# EAGLE design Balloon_Cut-Down (EAGLE 9.0.0)

## Sheet 1 of 2
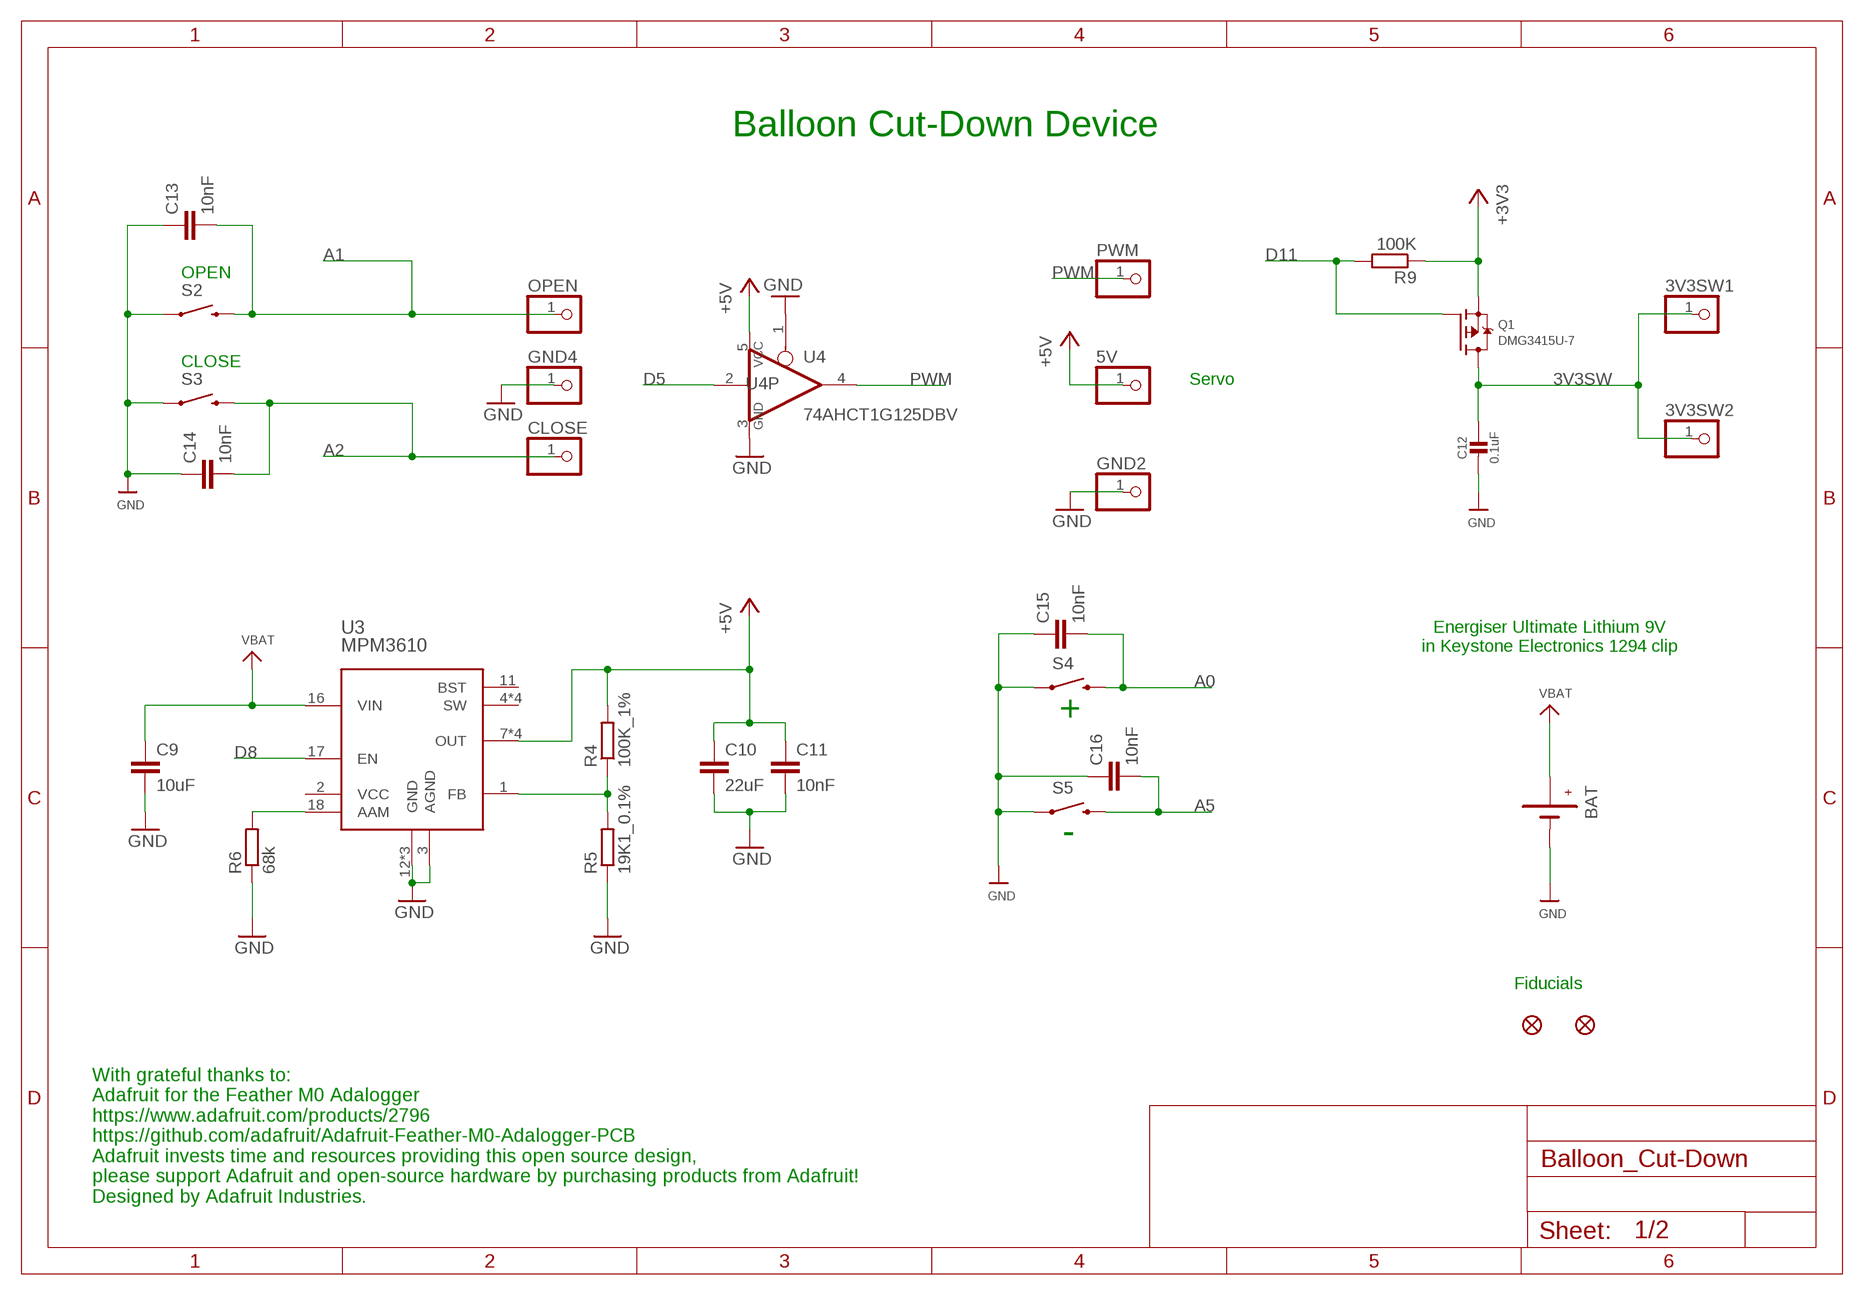
[diagram p0: schematic, sheet 1]

### Parts
3V3SW1  PINHD-1X1  [1X01]
3V3SW2  PINHD-1X1  [1X01]
5V  PINHD-1X1  [1X01]
BAT  BATTERYBATTERY-9V-KEYSTONE1294  [BATTERY-9V-KEYSTONE1294]
C9  10uF  C-EUC0805  [C0805]
C10  22uF  C-EUC0805  [C0805]
C11  10nF  C-EUC0805  [C0805]
C12  0.1uF  CAP_CERAMIC0805-NOOUTLINE  [0805-NO]
C13  10nF  C-EUC0805  [C0805]
C14  10nF  C-EUC0805  [C0805]
C15  10nF  C-EUC0805  [C0805]
C16  10nF  C-EUC0805  [C0805]
CLOSE  PINHD-1X1  [1X01]
FD1  FIDUCIAL1X2  [FIDUCIAL-1X2]
FD2  FIDUCIAL1X2  [FIDUCIAL-1X2]
GND2  PINHD-1X1  [1X01]
GND4  PINHD-1X1  [1X01]
OPEN  PINHD-1X1  [1X01]
PWM  PINHD-1X1  [1X01]
Q1  DMG3415U-7  MOSFET-PWIDE  [SOT23-WIDE]
R4  100K_1%  R-EU_R0805  [R0805]
R5  19K1_0.1%  R-EU_R0805  [R0805]
R6  68k  R-EU_R0805  [R0805]
R9  100K  R-EU_R0603  [R0603]
S2  SWITCH-MOMENTARY-2PTH  [TACTILE-PTH]
S3  SWITCH-MOMENTARY-2PTH  [TACTILE-PTH]
S4  SWITCH-MOMENTARY-2PTH  [TACTILE-PTH]
S5  SWITCH-MOMENTARY-2PTH  [TACTILE-PTH]
U3  MPM3610  2093_MPM3610GQV-P  [QFN-20]
U4  74AHCT1G125DBV  [SOT23-5]

### Nets
3V3SW: 3V3SW1.1 3V3SW2.1 C12.1 Q1.3(D)
+3V3: Q1.2(S) R9.1 ; also sheet 2
+5V: 5V.1 C10.1 C11.1 R4.2 U3.7(OUT) U3.8(OUT) U3.9(OUT) U3.20(OUT) U4.5(VCC)
A0: C15.2 S4.3 ; also sheet 2
A1: C13.2 OPEN.1 S2.3 ; also sheet 2
A2: C14.2 CLOSE.1 S3.3 ; also sheet 2
A5: C16.2 S5.3 ; also sheet 2
D5: U4.2(I) ; also sheet 2
D8: U3.17(EN) ; also sheet 2
D11: Q1.1(G) R9.2 ; also sheet 2
GND: BAT.GND(-) C9.2 C10.2 C11.2 C12.2 C13.1 C14.1 C15.1 C16.1 GND2.1 GND4.1 R5.1 R6.1 S2.1 S3.1 S4.1 S5.1 U3.3(AGND) U3.12(GND) U3.13(GND) U3.14(GND) U4.1(OE) U4.3(GND) ; also sheet 2
N$26: R4.1 R5.2 U3.1(FB)
N$29: R6.2 U3.18(AAM)
PWM: PWM.1 U4.4(O)
VBAT: BAT.PWR(+) C9.1 U3.16(VIN) ; also sheet 2
Unconnected: U3.2(VCC) U3.4(SW) U3.5(SW) U3.6(SW) U3.11(BST) U3.19(SW)

### Notes on the sheet
- Balloon Cut-Down Device
- OPEN
- CLOSE
- Servo
- Energiser Ultimate Lithium 9V
  in Keystone Electronics 1294 clip
- +
- -
- Fiducials
- With grateful thanks to:
  Adafruit for the Feather M0 Adalogger
  https://www.adafruit.com/products/2796
  https://github.com/adafruit/Adafruit-Feather-M0-Adalogger-PCB
  Adafruit invests time and resources providing this open source design,
  please support Adafruit and open-source hardware by purchasing products from Adafruit!
  Designed by Adafruit Industries.

## Sheet 2 of 2
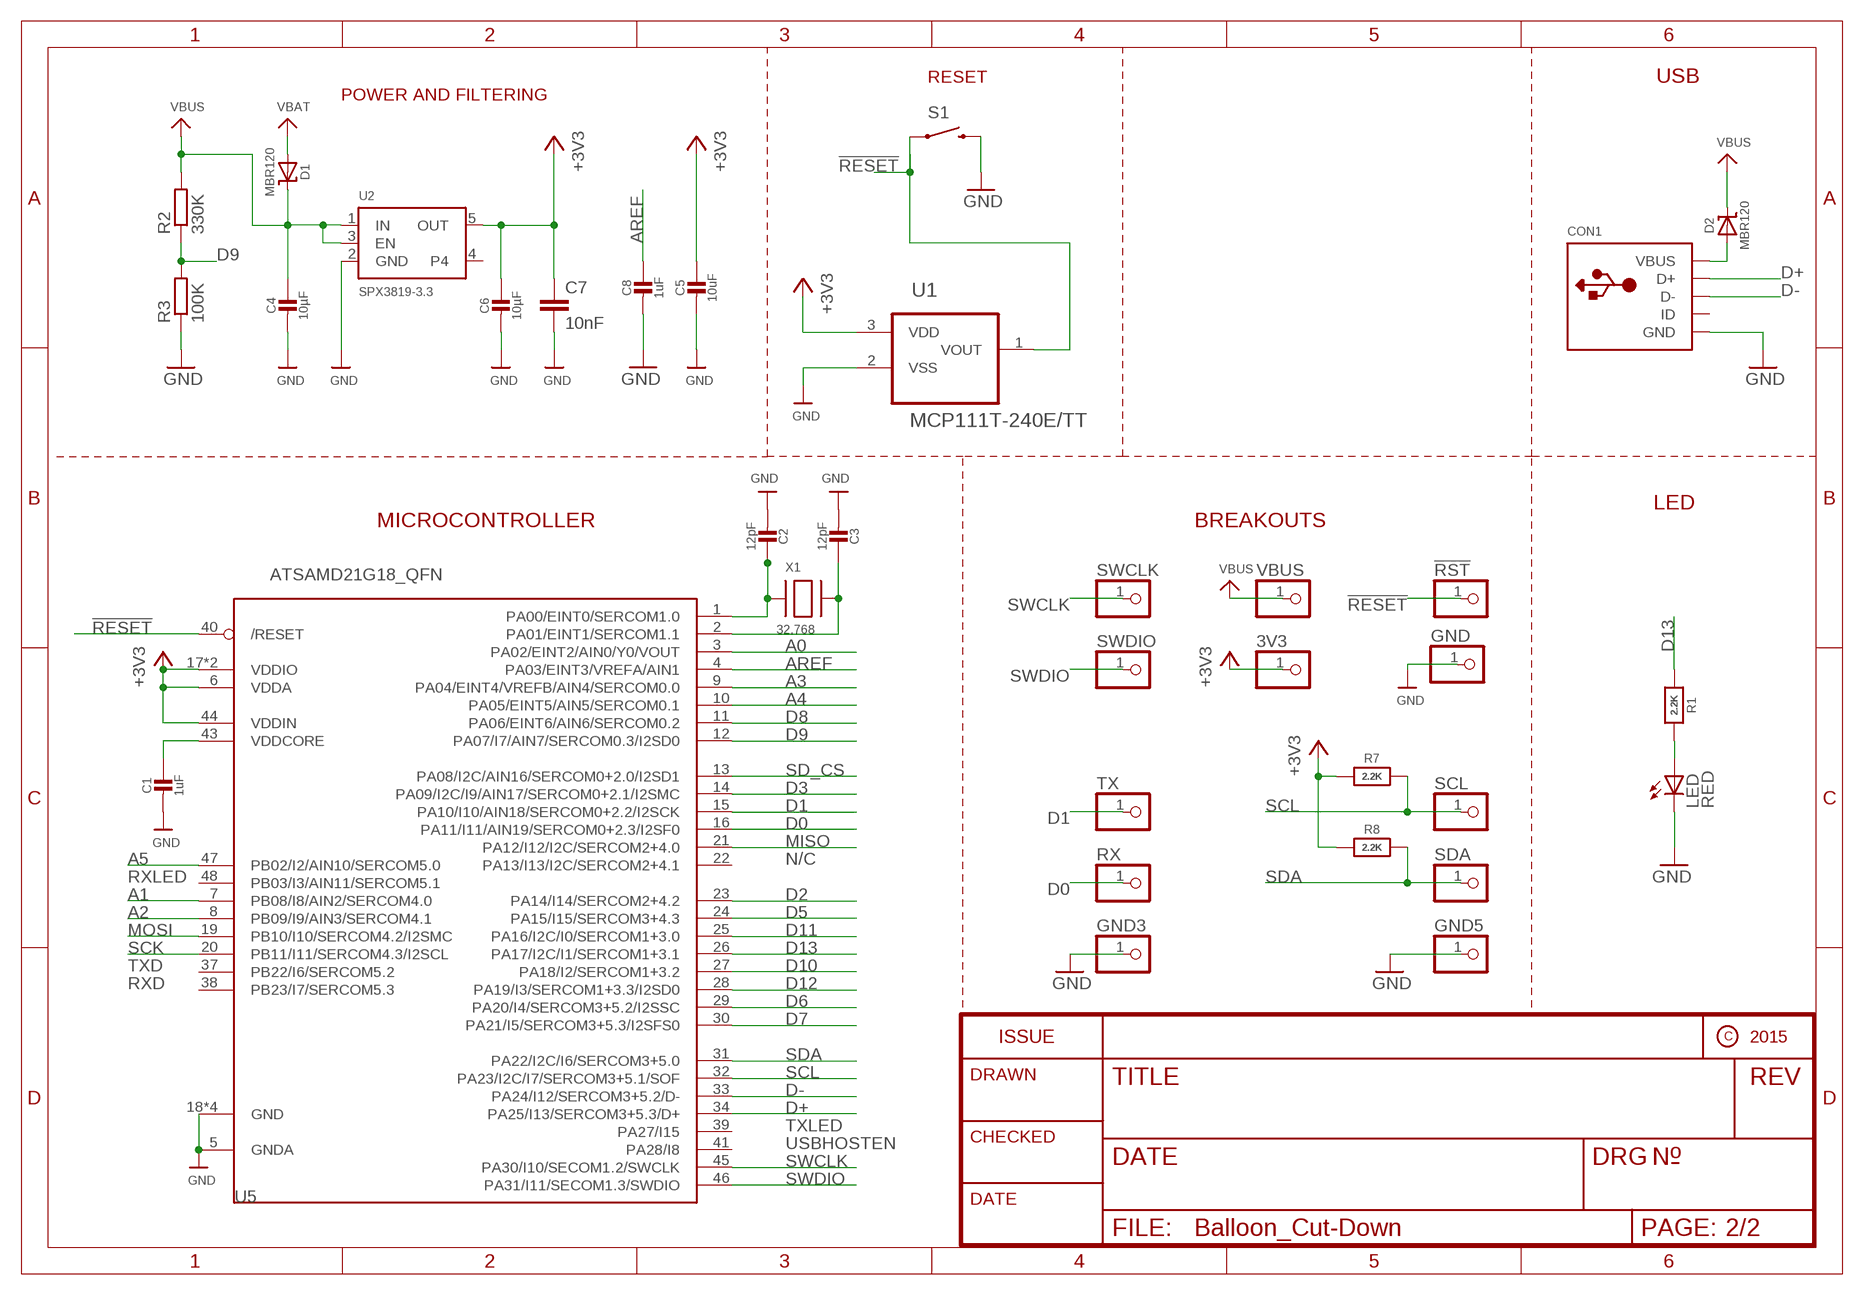
[diagram p1: schematic, sheet 2]

### Parts
3V3  PINHD-1X1  [1X01]
!RST  PINHD-1X1  [1X01]
C1  1uF  CAP_CERAMIC0603_NO  [0603-NO]
C2  12pF  CAP_CERAMIC0603_NO  [0603-NO]
C3  12pF  CAP_CERAMIC0603_NO  [0603-NO]
C4  10µF  CAP_CERAMIC0805-NOOUTLINE  [0805-NO]
C5  10uF  CAP_CERAMIC0805-NOOUTLINE  [0805-NO]
C6  10µF  CAP_CERAMIC0805-NOOUTLINE  [0805-NO]
C7  10nF  C-EUC0805  [C0805]
C8  1uF  CAP_CERAMIC0603_NO  [0603-NO]
CON1  USBFCI_10103594  [FCI_10103594]
D1  MBR120  DIODE-SCHOTTKYSOD-123  [SOD-123]
D2  MBR120  DIODE-SCHOTTKYSOD-123  [SOD-123]
GND  PINHD-1X1  [1X01]
GND3  PINHD-1X1  [1X01]
GND5  PINHD-1X1  [1X01]
LED  RED  LED3MM  [LED3MM]
R1  2.2K  RESISTOR_0603_NOOUT  [0603-NO]
R2  330K  R-EU_R0603  [R0603]
R3  100K  R-EU_R0603  [R0603]
R7  2.2K  RESISTOR_0603_NOOUT  [0603-NO]
R8  2.2K  RESISTOR_0603_NOOUT  [0603-NO]
RX  PINHD-1X1  [1X01]
S1  SWITCH-MOMENTARY-2PTH  [TACTILE-PTH]
SCL  PINHD-1X1  [1X01]
SDA  PINHD-1X1  [1X01]
SWCLK  PINHD-1X1  [1X01]
SWDIO  PINHD-1X1  [1X01]
TX  PINHD-1X1  [1X01]
U1  MCP111T-240E/TT  MCP111T-270E/TT  [SOT95P237X112-3N]
U2  SPX3819-3.3  VREG_SOT23-5  [SOT23-5]
U5  ATSAMD21G18_QFN  ATSAMD21J_QFN  [TQFN48_7MM]
VBUS  PINHD-1X1  [1X01]
X1  32.768  XTAL-3.2X1.5  [XTAL3215]

### Nets
!RESET: !RST.1 S1.1 U1.1(VOUT) U5.40(/RESET)
+3V3: 3V3.1 C5.1 C6.1 C7.1 R7.1 R8.1 U1.3(VDD) U2.5(OUT) U5.6(VDDA) U5.17(VDDIO) U5.36(VDDIO) U5.44(VDDIN) ; also sheet 1
A0: U5.3(PA02/EINT2/AIN0/Y0/VOUT) ; also sheet 1
A1: U5.7(PB08/I8/AIN2/SERCOM4.0) ; also sheet 1
A2: U5.8(PB09/I9/AIN3/SERCOM4.1) ; also sheet 1
A3: U5.9(PA04/EINT4/VREFB/AIN4/SERCOM0.0)
A4: U5.10(PA05/EINT5/AIN5/SERCOM0.1)
A5: U5.47(PB02/I2/AIN10/SERCOM5.0) ; also sheet 1
AREF: C8.1 U5.4(PA03/EINT3/VREFA/AIN1)
D0: RX.1 U5.16(PA11/I11/AIN19/SERCOM0+2.3/I2SF0)
D1: TX.1 U5.15(PA10/I10/AIN18/SERCOM0+2.2/I2SCK)
D2: U5.23(PA14/I14/SERCOM2+4.2)
D3: U5.14(PA09/I2C/I9/AIN17/SERCOM0+2.1/I2SMC)
D5: U5.24(PA15/I15/SERCOM3+4.3) ; also sheet 1
D6: U5.29(PA20/I4/SERCOM3+5.2/I2SSC)
D7: U5.30(PA21/I5/SERCOM3+5.3/I2SFS0)
D8: U5.11(PA06/EINT6/AIN6/SERCOM0.2) ; also sheet 1
D9: R2.1 R3.2 U5.12(PA07/I7/AIN7/SERCOM0.3/I2SD0)
D10: U5.27(PA18/I2/SERCOM1+3.2)
D11: U5.25(PA16/I2C/I0/SERCOM1+3.0) ; also sheet 1
D12: U5.28(PA19/I3/SERCOM1+3.3/I2SD0)
D13: R1.1 U5.26(PA17/I2C/I1/SERCOM1+3.1)
D+: CON1.D+ U5.34(PA25/I13/SERCOM3+5.3/D+)
D-: CON1.D- U5.33(PA24/I12/SERCOM3+5.2/D-)
GND: C1.2 C2.2 C3.2 C4.2 C5.2 C6.2 C7.2 C8.2 CON1.BASE@1(GND) CON1.BASE@2(GND) CON1.GND CON1.SPRT@1(GND) CON1.SPRT@2(GND) CON1.SPRT@3(GND) CON1.SPRT@4(GND) GND3.1 GND5.1 GND.1 LED.K(C) R3.1 S1.3 U1.2(VSS) U2.2(GND) U5.5(GNDA) U5.18(GND) U5.35(GND) U5.42(GND) U5.THERMAL(GND) ; also sheet 1
MISO: U5.21(PA12/I12/I2C/SERCOM2+4.0)
MOSI: U5.19(PB10/I10/SERCOM4.2/I2SMC)
N$3: LED.A R1.2
N$5: C2.1 U5.1(PA00/EINT0/SERCOM1.0) X1.P$1
N$7: C3.1 U5.2(PA01/EINT1/SERCOM1.1) X1.P$2
N$16: CON1.VBUS D2.A
SCK: U5.20(PB11/I11/SERCOM4.3/I2SCL)
SCL: R7.2 SCL.1 U5.32(PA23/I2C/I7/SERCOM3+5.1/SOF)
SD_CS: U5.13(PA08/I2C/AIN16/SERCOM0+2.0/I2SD1)
SDA: R8.2 SDA.1 U5.31(PA22/I2C/I6/SERCOM3+5.0)
SWCLK: SWCLK.1 U5.45(PA30/I10/SECOM1.2/SWCLK)
SWDIO: SWDIO.1 U5.46(PA31/I11/SECOM1.3/SWDIO)
VBAT: D1.A ; also sheet 1
VBUS: C4.1 D1.C D2.C R2.2 U2.1(IN) U2.3(EN) VBUS.1
VDDCORE1: C1.1 U5.43(VDDCORE)
Unconnected: CON1.ID U2.4 U5.22(PA13/I13/I2C/SERCOM2+4.1) U5.37(PB22/I6/SERCOM5.2) U5.38(PB23/I7/SERCOM5.3) U5.39(PA27/I15) U5.41(PA28/I8) U5.48(PB03/I3/AIN11/SERCOM5.1)

### Notes on the sheet
- RESET | USB
- POWER AND FILTERING
- LED
- MICROCONTROLLER | BREAKOUTS
- N/C
- RXLED
- TXD
- RXD
- TXLED
- USBHOSTEN

## Library data of the parts
3V3 3V3SW1 3V3SW2 5V !RST CLOSE GND GND2-GND5 OPEN PWM RX SCL SDA SWCLK SWDIO TX VBUS = adafruit:PINHD-1X1: Pin header 1x1 for 0.1" spacing With round pins
BAT = SparkFun-Electromechanical:BATTERY: Battery Holders Various common sizes : AA, AAA, 18650 (PRT-12895), 20mm coin cell and 12mm coin cell. 20MM_4LEGS, BATT-10373
C1-C6 C8 C12 = microbuilder:CAP_CERAMIC: Ceramic Capacitors For new designs, use the packages preceded by an '_' character since they are more reliable: The following footprints should be used on most boards: _0402 - Standard footprint for regular board layouts _0603 - Standard footprint for regular board layouts _0805 - Standard footprint for regular board layouts _1206 - Standard footprint for regular board layouts For extremely tight-pitch boards where space is at a premium, the following 'micro-pitch' footprints can be used (smaller pads, no silkscreen outline, etc.): _0402MP - Micro-pitch footprint for very dense/compact boards _0603MP - Micro-pitch footprint for very dense/compact boards _0805MP - Micro-pitch footprint for very dense/compact boards _1206MP - Micro-pitch footprint for very dense/compact boards
C7 C9-C11 C13-C16 = rcl:C-EU: CAPACITOR, European symbol; SPICEPREFIX: C
CON1 = microbuilder:USB: USB Connectors USBMINIB - Surface Mount Female Mini-B USB Connector 4UConnector: 06564
D1 D2 = microbuilder:DIODE-SCHOTTKY
FD1 FD2 = SparkFun-Aesthetics:FIDUCIAL: Fiducial Alignment Points Various fiducial points for machine vision alignment.
LED = adafruit:LED: LED OSRAM: - CHIPLED LG R971, LG N971, LY N971, LG Q971, LY Q971, LO R971, LY R971 LH N974, LH R974 LS Q976, LO Q976, LY Q976 LO Q996 - Hyper CHIPLED LW Q18S LB Q993, LB Q99A, LB R99A - SideLED LS A670, LO A670, LY A670, LG A670, LP A670 LB A673, LV A673, LT A673, LW A673 LH A674 LY A675 LS A676, LA A676, LO A676, LY A676, LW A676 LS A679, LY A679, LG A679 - Hyper Micro SIDELED® LS Y876, LA Y876, LO Y876, LY Y876 LT Y87S - SmartLED LW L88C, LW L88S LB L89C, LB L89S, LG L890 LS L89K, LO L89K, LY L89K LS L896, LA L896, LO L896, LY L896 - TOPLED LS T670, LO T670, LY T670, LG T670, LP T670 LSG T670, LSP T670, LSY T670, LOP T670, LYG T670 LG T671, LOG T671, LSG T671 LB T673, LV T673, LT T673, LW T673 LH T674 LS T676, LA T676, LO T676, LY T676, LB T676, LH T676, LSB T676, LW T676 LB T67C, LV T67C, LT T67C, LS T67K, LO T67K, LY T67K, LW E67C LS E67B, LA E67B, LO E67B, LY E67B, LB E67C, LV E67C, LT E67C LW T67C LS T679, LY T679, LG T679 LS T770, LO T770, LY T770, LG T770, LP T770 LB T773, LV T773, LT T773, LW T773 LH T774 LS E675, LA E675, LY E675, LS T675 LS T776, LA T776, LO T776, LY T776, LB T776 LHGB T686 LT T68C, LB T68C - Hyper Mini TOPLED® LB M676 - Mini TOPLED Santana® LG M470 LS M47K, LO M47K, LY M47K Source: http://www.osram.convergy.de/
Q1 = microbuilder:MOSFET-P: P-Channel Mosfet LEGEND VDS: Voltage Drain-Source ID: Drain Current RDS(ON): Drain-Source On-State Resistance VGS(TH): Gate-Source Threshold Voltage CISS: Drain-Source Input Capacitance SOT-23 Name VDS ID RDS(ON) VGS(TH) CISS Order Number IRLML5103 30V 760mA 600 mOhm -- 75pF @ 25V Digikey: IRLML5103PBFCT-ND IRLML6401 12V 4.3A 50 mOhm 950mV @ 250µA 830pF @ 10V Digikey: IRLML6401PBFTR-ND NTR0202PL 20V 400mA 800 mOhm 2.3V @ 250uA 70pF @ 5V Digikey: NTR0202PLT1GOSTR-ND NTR4101PT1G 20V 1.8A 85 mOhm 1.2V @ 250uA 675pF @ 10V Digikey: NTR4101PT1GOSCT-ND DMP2004K 20V 600mA 900 mOhm 1V @ 250uA 175pF @ 16V Digikey: DMP2004KDICT-ND PMV65XP 20V 3.9A 76 mOhm 950mV @ 1mA 725pF @ 20V Digikey: 568-2358-2-ND TO-252 Name VDS ID RDS(ON) VGS(TH) CISS Order Number AOD417 30V 25A 34 mOhm 3V @ 250µA 920pF @ 15V Digikey: 785-1106-2-ND
R1 R7 R8 = microbuilder:RESISTOR: Resistors For new designs, use the packages preceded by an '_' character since they are more reliable: The following footprints should be used on most boards: _0402 - Standard footprint for regular board layouts _0603 - Standard footprint for regular board layouts _0805 - Standard footprint for regular board layouts _1206 - Standard footprint for regular board layouts For extremely tight-pitch boards where space is at a premium, the following 'micro-pitch' footprints can be used (smaller pads, no silkscreen outline, etc.): _0402MP - Micro-pitch footprint for very dense/compact boards _0603MP - Micro-pitch footprint for very dense/compact boards _0805MP - Micro-pitch footprint for very dense/compact boards _1206MP - Micro-pitch footprint for very dense/compact boards
R2-R6 R9 = rcl:R-EU_: RESISTOR, European symbol; SPICEPREFIX: R
S1-S5 = SparkFun-Electromechanical:SWITCH-MOMENTARY-2: Various NO switches- pushbuttons, reed, etc; PROD_ID: SWCH-08441
U1 = Microchip-MCP11:MCP11: Micropower Voltage Detector ,SOT23-3;; MPN: MCP111T-240E/TT; OC_FARNELL: 1851877; OC_NEWARK: 56J7328; PACKAGE: SOT23-3; SUPPLIER: MICROCHIP
U2 = microbuilder:VREG_SOT23-5: SOT23-5 Fixed Voltage Regulators Part Current Out V Out V In V Dropout θJA (°C/W) TJ (°C) Digikey Part No. ADP121 150mA 3.3V 3.4-5.5V 0.09V @ 150mA -- -- ADP121-AUJZ33R7CT-ND ADP121 150mA 3.0V 3.1-5.5V 0.09V @ 150mA -- -- ADP121-AUJZ30R7CT-ND ADP122 300mA 3.3V 3.4-5.5V 0.085V @ 300mA -- -- ADP122AUJZ-3.3-R7CT-ND ADP1712 300mA 3.3V 3.5-5.5V 0.17V @ 300mA -- -- ADP1712AUJZ-3.3-R7TR-ND AP7311 (Low Cost) 150mA 3.3V 3.5-6V 0.15V @ 150mA -- -- AP7311-33WG-7DICT-ND LD39015M18R 150mA 1.8V 1.9V-5.5V 0.08V @ 100mA -- -- 497-6977-1-ND LP2985A-33DBVR 150mA 3.3V 3.3-16V 0.28V @ 150mA 206 150 296-18479-1-ND MCP1824T-3302E/OT 300mA 3.3V 3.5V-6V 0.2V @ 300mA -- -- MCP1824T-3302E/OTCT-ND MIC5205-2.5YM5 TR 150mA 2.5V 2.7-16V 0.165V @ 150mA -- -- 576-1257-2-ND MIC5205-3.0YM5 TR 150mA 3.0V 3.2V-16V 0.165V @ 150mA -- -- 576-1258-2-ND MIC5205-3.3YM5 TR 150mA 3.3V 3.5V-16V 0.165V @ 150mA -- -- 576-1259-2-ND TPS780330220 150mA 3.3V+2.2V 3.6-5.5V 250mV Max -- -- 296-23332-1-ND TDA3663/N1,135 100mA 3.3V 3.5-45V 0.18V @ 50mA -- -- 568-5343-1-ND Max operating temp can be calculated using θJA, TJ (max junction temperature), and power in watts. Set the "Maximum Ambient Temperature" until it reaches TJ ("Max Junction Temperature"), which is the absolute limit for safe use of the regulator: Heat Sink Temperature Calculator <http://www.daycounter.com/Calculators/Heat-Sink-Temperature-Calculator.phtml> For example, With 12V source into a 3.3V LP2985 and a 30mA load, we are dissipating (12V-3.3V) * 0.03A = 0.261W. With a θJA of 206 °C/W, a TJ of 150°C, and 261mW we can safely use the chip without a heat sink up to 75°C (=147.1°C Junction Temperature).
U3 = IntegratedCircuits:2093_MPM3610GQV-P: MPM3610 Step Down Regulator; CASE: QFN-20; PART_NUMBER: MPM3610GQV-P; TYPE: Circuito_Integrato
U4 = 74xx-little-us:74*1G125: Single Bus Buffer Gate with 3-State Output
U5 = microbuilder:ATSAMD21J
X1 = adafruit2:XTAL: Low cost SMT crystals, no capacitors included http://www.ladyada.net/library/eagle

## Net classes
2 gnd: width 0.254 mm, drill 0.254 mm, clearance 0.178 mm
3 usbvcc: width 0.203 mm, drill 0.406 mm, clearance 0.178 mm

## Board
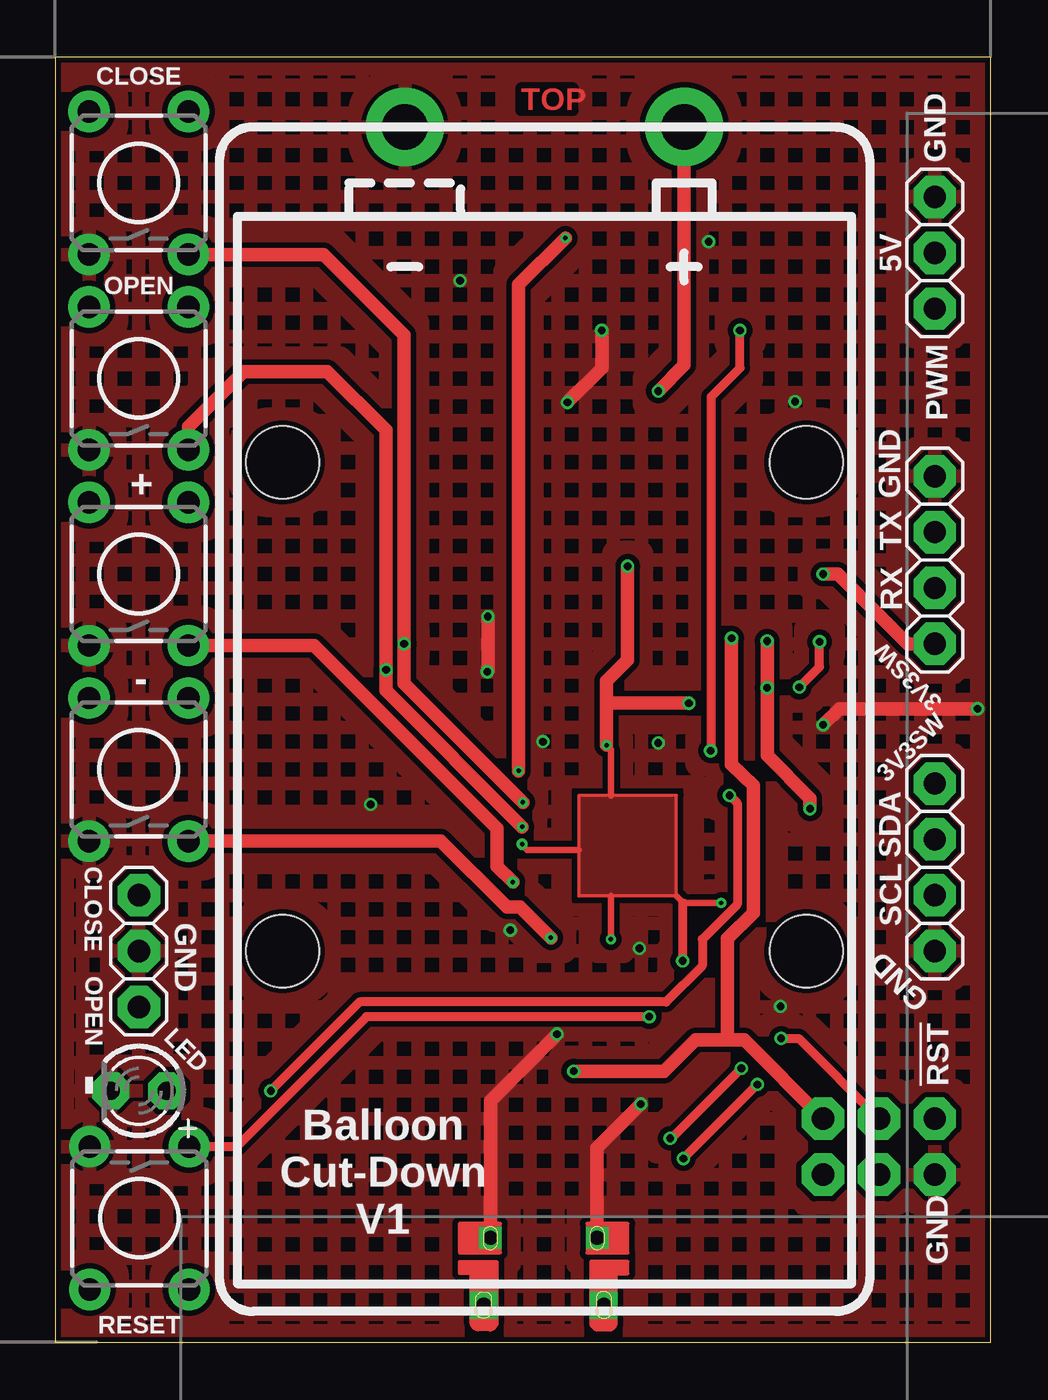
[diagram p2: board, top side]
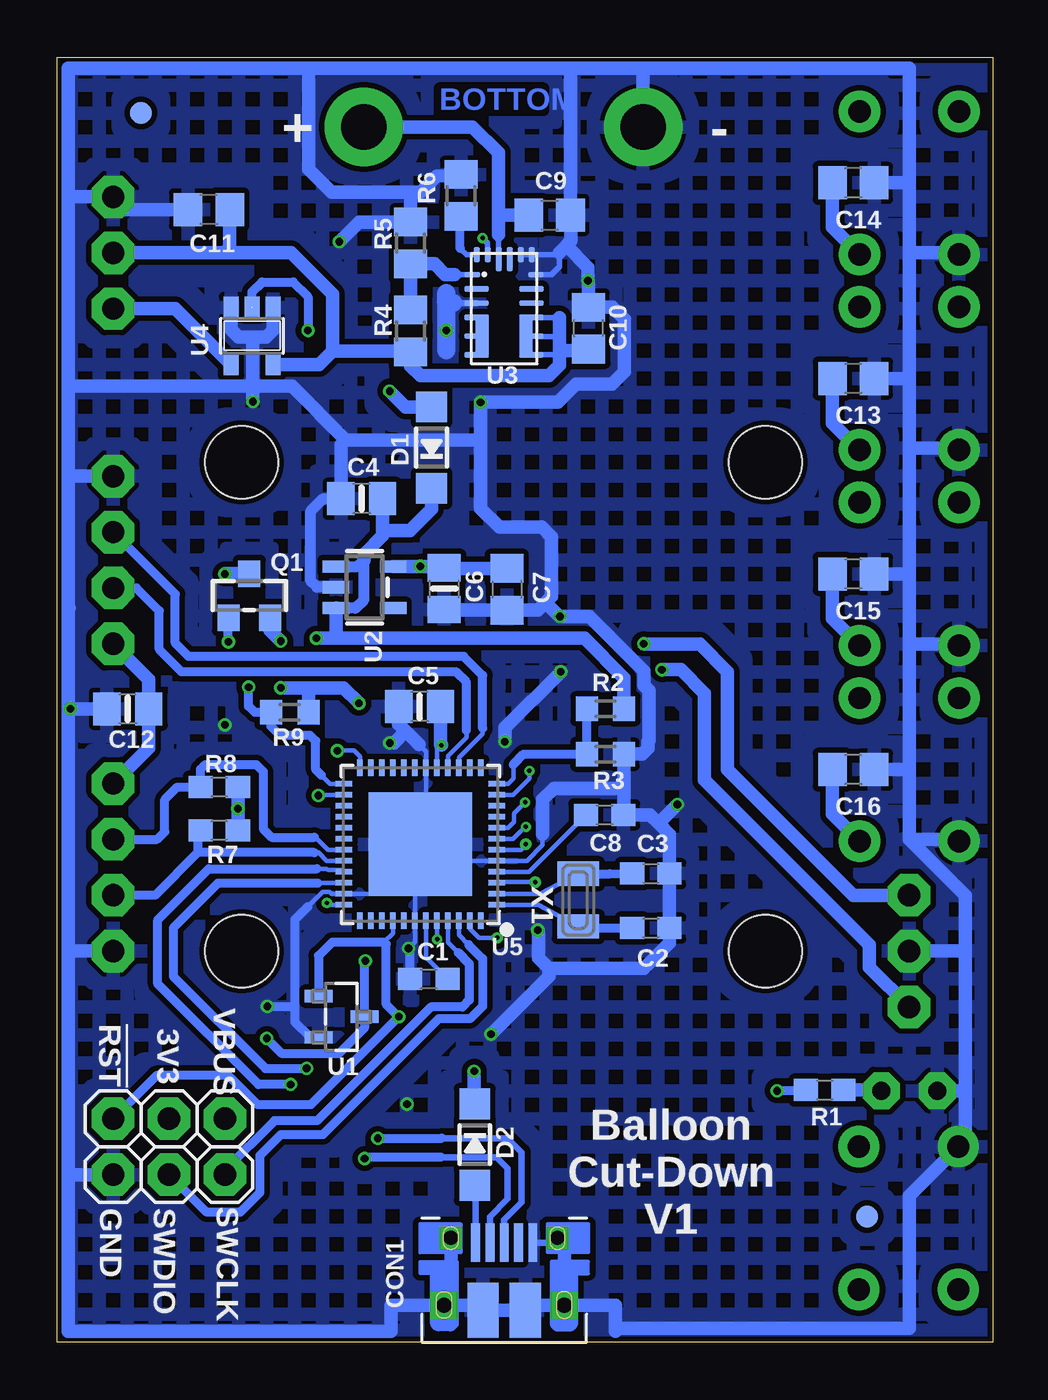
[diagram p3: board, bottom side, seen from below]

Size 42.55 x 58.42 mm. Coordinates in mm from the lower left corner, seen from the top.
Outline: 0,0 42.55,0 42.55,58.42 0,58.42 0,0
Copper layers (1*16): Top 0.018mm / dielectric 1.55mm / Bottom 0.018mm
Design rules "Multi-CB_2L_125um-Tracks_OL35um *": minimum track width 0.125mm, minimum drill 0.2mm, track to track 0.125mm, track to pad 0.125mm, pad to pad 0.125mm, via to via 0.125mm, smd to smd 0mil, copper to edge 0.2mm, drill to drill 0.2mm, minimum pad ring 0.125mm, minimum via ring 0.125mm, stop-mask expansion 2mil, vias tented up to drill 0.45mm, thermal gap 0.2mm

### Footprints (pad centres in the part's own frame; a part is rotated, then mirrored left to right if it is on the bottom)
1X01 = drill 1.016 pad 1.93 octagon: 1 0,0
BATTERY-9V-KEYSTONE1294 = drill 2.057 pad 3.556: GND 0,-6.35; PWR 0,6.35 | hole 3.302: 15.24,11.913; 37.465,11.913; 15.24,-11.913; 37.465,-11.913
0603-NO = smd 1.1 x 1: 1 -0.85,0; 2 0.85,0
0805-NO = smd 1.24 x 1.5: 1 -0.95,0; 2 0.95,0
C0805 = smd 1.3 x 1.5: 1 -0.95,0; 2 0.95,0
FCI_10103594 = smd 1.425 x 2.5: BASE@1 -0.963,1.45; BASE@2 0.963,1.45 | smd 0.4 x 1.75: D+ 0,4.525; D- -0.65,4.525; GND 1.3,4.525; ID 0.65,4.525; VBUS -1.3,4.525 | drill 0.7 pad 1.25 square: SPRT@1 -2.736,1.679; SPRT@2 2.736,1.679 | drill 0.65 pad 1.016 square: SPRT@3 -2.426,4.747; SPRT@4 2.426,4.747
SOD-123 = smd 1.4 x 1.4: A 1.85,0; C -1.85,0
FIDUCIAL-1X2 = smd 1 x 1: 1 0,0
LED3MM = drill 0.813 pad 1.676 octagon: A -1.27,0; K 1.27,0
SOT23-WIDE = smd 1 x 1.2: 1 -0.95,-1; 2 0.95,-1; 3 0,1
R0603 = smd 1 x 1.1: 1 -0.85,0; 2 0.85,0
R0805 = smd 1.3 x 1.5: 1 -0.95,0; 2 0.95,0
TACTILE-PTH = drill 1.016 pad 1.88: 1 -3.251,2.261; 2 3.251,2.261; 3 -3.251,-2.261; 4 3.251,-2.261
SOT95P237X112-3N = smd 0.559 x 1.27: 1 -0.94,-1.041; 2 0.94,-1.041; 3 0,1.041
SOT23-5 = smd 0.55 x 1.2: 1 -0.95,-1.3; 2 0,-1.3; 3 0.95,-1.3; 4 0.95,1.3; 5 -0.95,1.3
QFN-20 = smd 0.7 x 0.25: 1 -1.45,1.55; 4 -1.45,-0.4; 5 -1.45,-1.25; 6 -1.45,-2.1; 7 1.45,-2.1; 8 1.45,-1.25; 9 1.45,-0.4; 12 1.45,1.55 | smd 1.1 x 0.25: 2 -1.25,0.9; 3 -1.25,0.25; 10 1.25,0.25; 11 1.25,0.9 | smd 0.25 x 0.7: 13 1.25,2.45; 14 0.75,2.45; 17 -0.75,2.45; 18 -1.25,2.45 | smd 0.25 x 1.1: 15 0.25,2.25; 16 -0.25,2.25 | smd 0.6 x 1.95: 19 -1,-1.25; 20 1,-1.25
SOT23-5' = smd 0.69 x 0.99: 1 -0.95,-1.29; 2 0,-1.29; 3 0.95,-1.29; 4 0.95,1.3; 5 -0.95,1.3
TQFN48_7MM = smd 0.25 x 0.75: 1 -2.75,-3.475; 2 -2.25,-3.475; 3 -1.75,-3.475; 4 -1.25,-3.475; 5 -0.75,-3.475; 6 -0.25,-3.475; 7 0.25,-3.475; 8 0.75,-3.475; 9 1.25,-3.475; 10 1.75,-3.475; 11 2.25,-3.475; 12 2.75,-3.475; 25 2.75,3.475; 26 2.25,3.475; 27 1.75,3.475; 28 1.25,3.475; 29 0.75,3.475; 30 0.25,3.475; 31 -0.25,3.475; 32 -0.75,3.475; 33 -1.25,3.475; 34 -1.75,3.475; 35 -2.25,3.475; 36 -2.75,3.475 | smd 0.75 x 0.25: 13 3.475,-2.75; 14 3.475,-2.25; 15 3.475,-1.75; 16 3.475,-1.25; 17 3.475,-0.75; 18 3.475,-0.25; 19 3.475,0.25; 20 3.475,0.75; 21 3.475,1.25; 22 3.475,1.75; 23 3.475,2.25; 24 3.475,2.75; 37 -3.475,2.75; 38 -3.475,2.25; 39 -3.475,1.75; 40 -3.475,1.25; 41 -3.475,0.75; 42 -3.475,0.25; 43 -3.475,-0.25; 44 -3.475,-0.75; 45 -3.475,-1.25; 46 -3.475,-1.75; 47 -3.475,-2.25; 48 -3.475,-2.75 | smd 4.7 x 4.7: THERMAL 0,0
XTAL3215 = smd 1.1 x 1.9: P$1 1.2,0; P$2 -1.2,0

### Placement (x,y rotation side)
3V3  37.47,10.16 270 bottom
3V3SW1  40.01,25.4 0 top
3V3SW2  40.01,31.75 0 top
5V  40.01,49.53 90 top
!RST  40.01,10.16 270 bottom
BAT  22.26,55.24 270 top
C1  25.65,16.51 180 bottom
C2  15.56,18.83 0 bottom
C3  15.56,21.3 0 bottom
C4  28.7,38.35 180 bottom
C5  26.07,28.89 180 bottom
C6  24.96,34.26 270 bottom
C7  22.1,34.23 270 bottom
C8  17.65,23.97 0 bottom
C9  20.16,51.24 0 bottom
C10  18.38,46.1 90 bottom
C11  35.66,51.5 180 bottom
C12  39.34,28.8 180 bottom
C13  6.35,43.81 180 bottom
C14  6.35,52.7 180 bottom
C15  6.35,34.92 180 bottom
C16  6.35,26.04 180 bottom
CLOSE  3.81,20.32 270 top
CON1  22.23,0 0 bottom
D1  25.53,40.67 90 bottom
D2  23.56,8.99 270 bottom
FD1  5.71,5.71 0 bottom
FD2  38.73,55.88 0 bottom
GND  40.01,7.62 90 bottom
GND2  40.01,52.07 90 top
GND3  40.01,39.37 90 top
GND4  3.81,17.78 270 top
GND5  40.01,17.78 0 top
LED  3.81,11.43 180 top
OPEN  3.81,15.24 270 top
PWM  40.01,46.99 270 top
Q1  33.81,33.94 0 bottom
R1  7.65,11.46 0 bottom
R2  17.62,28.8 0 bottom
R3  17.62,26.73 180 bottom
R4  26.48,45.97 270 bottom
R5  26.48,49.97 270 bottom
R6  24.19,52.13 270 bottom
R7  35.18,23.27 180 bottom
R8  35.18,25.24 180 bottom
R9  31.97,28.64 180 bottom
RX  40.01,34.29 270 top
S1  3.84,5.64 270 top
S2  3.81,43.81 90 top
S3  3.81,52.7 90 top
S4  3.81,34.92 90 top
S5  3.81,26.04 90 top
SCL  40.01,20.32 0 top
SDA  40.01,22.86 0 top
SWCLK  34.92,7.62 270 bottom
SWDIO  37.47,7.62 270 bottom
TX  40.01,36.83 270 top
U1  29.62,14.8 270 bottom
U2  28.57,34.32 270 bottom
U3  22.23,46.99 0 bottom
U4  74AHCT1G125DBV  [SOT23-5']  33.69,45.75 180 bottom
U5  26.04,22.64 90 bottom
VBUS  34.92,10.16 270 bottom
X1  18.86,20.1 270 bottom

### Tracks (layer width: path | path; a pad name or v marks a point on that pad's centre or on a via)
3V3SW  (via drill 0.35)
  Top 0.61: v34.92,34.92 35.59,34.92 38.77,31.75 3V3SW2.1
  Bottom 0.61: 3V3SW2.1 38.39,30.13 C12.1 38.39,27.02 3V3SW1.1 | Q1.3 34.91,34.94 v34.92,34.92
!RESET  (via drill 0.35)
  Top 0.406: v27.02,14.8 14.16,14.8 8.26,8.89 S1.1
  Bottom 0.203: 27.69,18.19 27.29,18.59 U5.40
  Bottom 0.406: !RST.1 38.04,12.13 34.77,12.13 33.43,10.79 31.02,10.79 v27.02,14.8 27.59,15.37 27.59,18.1 27.69,18.19 30.04,18.19 30.66,17.56 U1.1
+3V3  (via drill 0.2 pad 0.46, 0.2 pad 0.51, 0.35)
  Top 0.127: 25.29,24.86 28.26,24.86 28.26,20.29 25.27,20.29 23.81,20.29 23.81,22.38 23.81,24.86 25.27,24.86 25.29,24.86 | 25.29,24.86 U5.17
  Top 0.305: 23.81,22.38 21.46,22.38 21.24,22.61 v21.24,22.64 | v25.27,18.32 25.27,20.29 | 28.26,20.29 28.57,19.97 v30.29,19.97 | v25.08,27.15 25.27,26.96 25.27,24.86
  Top 0.406: v33.02,13.81 33.81,13.81 3V3.1 | v28.54,17.34 28.54,19.94 28.57,19.97
  Top 0.61: v26.04,35.27 26.04,31.02 25.08,30.07 25.08,29.21 | 25.08,29.21 v25.08,27.15 | 25.08,29.21 25.24,29.05 v28.83,29.05 | v32.38,31.88 v32.38,29.75 32.38,26.67 34.33,24.73 v34.33,24.26
  Bottom 0.127: U5.36 29.55,19.84 | U5.44 25.27,19.15
  Bottom 0.203: U5.17 25.29,27.01 v25.08,27.15 | 25.27,19.15 v25.27,18.32 | v30.29,19.97 30.21,19.89 U5.36 | U5.6 21.46,22.39 21.24,22.61 v21.24,22.64
  Bottom 0.305: v21.24,22.64 21.21,22.64
  Bottom 0.406: v28.54,17.34 28.58,17.3 U1.3 28.58,14.28 29.75,13.11 32.32,13.11 v33.02,13.81
  Bottom 0.61: C7.1 24.92,35.18 C6.1 25.02,35.27 v26.04,35.27 U2.5 | C5.1 25.12,27.18 v25.08,27.15 | v28.83,29.05 29.53,29.75 31.11,29.75 | v32.38,31.88 32.86,32.36 Q1.2 | 31.11,29.75 v32.38,29.75 | R8.1 v34.33,24.26 R7.1 | R9.1 31.12,29.74 31.11,29.75
  pour Top: 28.26,24.86 23.81,24.86 23.81,20.29 28.26,20.29
+5V
  Bottom 0.203: U3.8 U3.20
  Bottom 0.254: U3.9 19.73,46.59 19.72,46.58 | U3.8 20.75,45.72 19.72,45.72 | U3.7 19.84,44.89 19.72,44.77
  Bottom 0.61: 19.72,46.58 19.72,45.72 19.72,45.09 | 19.72,45.09 19.72,44.77 19.72,44.42 20.19,43.94 26.04,43.94 26.48,44.39 R4.2 26.51,45.05 30.04,45.05 | 30.04,45.05 30.04,47.66 31.91,49.53 34.92,49.53 | U4.5 30.64,44.45 30.04,45.05 | 34.92,49.53 5V.1 | C10.1 18.45,45.09 19.72,45.09 | C11.1 34.7,49.75 34.92,49.53
A0  (via drill 0.2 pad 0.51)
  Top 0.61: v20.82,20.91 20.1,21.63 20.1,23.37 11.79,31.67 S4.3
  Bottom 0.203: U5.3 22.53,20.91 v20.82,20.91
  Bottom 0.61: C15.2 7.3,32.9 S4.3
A1  (via drill 0.2, 0.35)
  Top 0.61: v21.24,23.43 15.05,29.62 v15.05,30.57 15.05,41.47 12.38,44.13 8.57,44.13 6.07,41.63 S2.3
  Bottom 0.203: v21.24,23.43 21.27,23.43 21.82,22.89 U5.7
  Bottom 0.61: v15.05,30.57 14.19,30.57 13.11,29.5 13.11,25.56 5.62,18.07 5.62,17.05 OPEN.1 | C13.2 7.3,41.79 S2.3
A2  (via drill 0.2, 0.35)
  Top 0.61: v21.27,24.54 15.88,29.94 v15.88,31.75 15.88,45.78 12.21,49.45 S3.3
  Bottom 0.203: v21.27,24.54 21.78,24.04 21.78,23.65 22.05,23.39 U5.8
  Bottom 0.61: CLOSE.1 6.35,20.32 12.06,26.04 12.06,30.48 13.34,31.75 v15.88,31.75 | C14.2 7.3,50.68 S3.3
A5  (via drill 0.2 pad 0.51)
  Top 0.61: v22.54,18.38 21.14,19.78 20.54,19.78 17.54,22.78 S5.3
  Bottom 0.203: U5.47 23.79,18.8 23.37,18.38 v22.54,18.38
  Bottom 0.61: C16.2 7.3,24.01 S5.3
AREF
  Bottom 0.203: U5.4 21.09,21.39 C8.1
D0
  Bottom 0.203: U5.16 24.79,26.65 23.94,27.5 23.94,27.81
  Bottom 0.406: 23.94,27.81 23.94,30 24.42,30.48 36.89,30.48 37.91,31.5 37.91,33.24 38.96,34.29 RX.1
D1
  Bottom 0.203: U5.15 24.29,26.58 23.21,27.65 23.21,27.91
  Bottom 0.406: 23.21,27.91 23.21,30.32 24.07,31.18 36.58,31.18 37.18,31.78 37.18,34 TX.1
D5  (via drill 0.35)
  Top 0.406: v31.15,46.01 31.15,44.29 29.84,42.99 29.84,26.92 v29.81,26.89
  Bottom 0.203: U5.24 28.79,26.63 29.05,26.89 v29.81,26.89
  Bottom 0.406: U4.2 33.69,47.75 33.24,48.2 31.81,48.2 31.15,47.53 v31.15,46.01
D6
  Bottom 0.127: 29.52,23.4 U5.29
D8  (via drill 0.2)
  Top 0.61: v21.08,25.97 21.08,48.07 v23.21,50.2
  Bottom 0.203: U5.11 21.82,24.89 21.08,25.62 v21.08,25.97
  Bottom 0.254: v23.21,50.2 22.98,49.96 U3.17
D9
  Bottom 0.203: U5.12 22.05,25.39 21.81,25.62 21.81,26.26
  Bottom 0.406: R2.1 R3.2 21.34,26.73 21.81,26.26
D11  (via drill 0.35)
  Top 0.406: v33.85,29.78 34.77,30.7 v34.77,31.84
  Bottom 0.203: U5.25 30.15,25.39 30.54,25.78
  Bottom 0.406: v34.77,31.84 Q1.1 | 30.54,25.78 30.8,26.04 30.8,27.34 31.05,27.59 32.42,27.59 32.82,28 R9.2 33.56,28.64 33.85,28.92 v33.85,29.78
D13  (via drill 0.35)
  Top 0.406: v30.67,24.86 31.02,24.51 31.02,19.91 29.43,18.32 29.43,17.11 27.78,15.46 13.84,15.46 v9.81,11.43
  Bottom 0.203: v30.67,24.86 30.64,24.89 U5.26
  Bottom 0.406: R1.1 8.61,11.44 v9.81,11.43
D+  (via drill 0.35)
  Top 0.406: v31.21,12.45 28.04,9.27 v27.97,9.27
  Bottom 0.203: U5.34 30.67,20.89 30.7,20.86
  Bottom 0.305: 25.05,9.27 22.07,9.27 21.43,8.64 21.43,6.35 22.23,5.56 CON1.D+
  Bottom 0.406: 30.7,20.86 35.24,20.86 37.27,18.83 37.27,16.64 33.08,12.45 v31.21,12.45 | v27.97,9.27 25.05,9.27
D-  (via drill 0.35)
  Top 0.406: v28.57,8.35 v31.94,11.72
  Bottom 0.203: 30.73,21.53 30.29,21.53 30.23,21.46 29.59,21.46 U5.33
  Bottom 0.305: CON1.D- 22.88,5.7 22.07,6.51 22.07,7.91 22.57,8.41 25.11,8.41
  Bottom 0.406: 25.11,8.41 28.51,8.41 v28.57,8.35 | v31.94,11.72 33.4,11.72 37.97,16.29 37.97,19.21 35.66,21.53 30.73,21.53
GND  (via drill 0.35)
  Top 0.61: v19.68,32.99 19.68,30.51 v19.65,30.48 | v24.86,46.01 24.86,44.29 v23.3,42.73 | v26.64,10.83 24.65,8.84 CON1.SPRT@3 | v22.83,14 19.8,10.97 CON1.SPRT@4 | v34.92,28.07 35.66,28.8 v41.95,28.8
  Bottom 0.203: 25.84,22.45 25.29,21.89 U5.5 21.2,21.89 20.48,22.61 20.48,23.11 | 25.84,22.45 U5.THERMAL 26.29,22.39 26.29,22.26 | 26.29,22.26 U5.42 26.29,18.2 26.51,17.97 v26.57,17.91 | 25.84,22.45 25.79,22.51 U5.18 25.79,26.86 26.1,27.18 | 26.29,22.26 28.15,20.39 U5.35 30.06,20.39 30.1,20.43 30.11,20.43 30.16,20.48 30.48,20.48 31.14,19.81 31.15,19.81
  Bottom 0.254: U3.14 U3.13 19.81,49.44 19.72,49.53 19.72,48.9 20.07,48.54 U3.12
  Bottom 0.305: CON1.GND 19.8,4.53 CON1.SPRT@4 | U3.3 24.55,47.24
  Bottom 0.406: 31.15,19.81 31.75,19.21 31.75,15.24 | 26.42,16.6 C1.2 26.5,17.96 26.51,17.97 | U1.2 31.03,13.86 31.75,14.57 31.75,15.24 | v32.99,15.27 31.78,15.27 31.75,15.24
  Bottom 0.508: U2.2 30.73,34.32 31.02,34.61 31.02,37.78 30.45,38.35 C4.2
  Bottom 0.61: BAT.GND 15.91,57.91 | CON1.SPRT@2 17.18,1.68 17.18,0.64 | 17.18,0.51 17.18,0.64 | CON1.SPRT@2 21.26,1.68 CON1.BASE@2 CON1.BASE@1 23.19,1.68 24.65,1.68 | 24.65,1.68 CON1.SPRT@1 27.37,1.68 27.37,0.51 42.04,0.51 42.04,7.62 | 42.04,7.62 GND.1 | CON1.SPRT@4 19.49,4.75 CON1.SPRT@2 | CON1.SPRT@3 24.65,1.68 | 42.04,7.62 42.04,17.78 | 42.04,17.78 42.04,28.89 | 42.04,28.89 42.04,33.4 | 42.04,33.4 42.04,39.43 | 42.04,39.43 42.04,43.37 | 42.04,43.37 42.04,52.07 | 42.04,52.07 42.04,57.91 31.11,57.91 | 19.05,57.91 15.91,57.91 | U4.1 32.74,46 33.05,45.69 33.66,45.69 | 33.66,45.69 34.29,45.69 34.64,46.03 U4.3 | 33.66,45.69 33.66,43.47 | R6.1 25.3,53.02 26.04,52.29 26.42,52.29 | 19.4,49.85 19.18,50.07 19.18,51.21 C9.2 19.21,57.75 19.05,57.91 | 19.4,49.85 19.72,49.53 | 26.42,52.29 30.07,52.29 31.11,53.34 31.11,57.91 | C6.2 24.92,33.28 C7.2 20.7,33.28 20.35,33.62 | 16.77,25.18 R3.1 15.94,26.73 15.68,26.99 15.68,27.3 15.65,27.34 15.65,29.62 15.88,29.84 15.88,30.51 18.35,32.99 v19.68,32.99 19.72,32.99 20.35,33.62 | 16.77,25.18 16.77,24 C8.2 15.59,23.97 15.18,23.56 | 15.18,23.56 14.71,23.09 C3.2 C2.2 14.71,18.15 15.88,16.99 20.19,16.99 | 26.1,27.18 26.7,27.78 | 26.7,27.78 27.02,28.1 C5.2 | 20.48,23.11 20.48,24.67 19.97,25.18 16.77,25.18 | 20.35,33.62 20.07,33.91 20.07,36.61 20.51,37.05 22.45,37.05 23.3,37.91 23.3,41.02 | 42.01,33.37 42.04,33.4 | 33.66,43.47 31.88,43.47 29.43,41.02 | 23.3,41.02 29.43,41.02 | 33.66,43.47 41.95,43.47 42.04,43.37 | 19.4,49.85 18.41,48.86 v18.41,48.26 18.38,48.23 C10.2 17.3,47.05 16.76,46.51 16.76,44.13 17.34,43.56 18.95,43.56 19.78,42.73 v23.3,42.73 23.3,41.02 | 20.19,16.99 20.67,17.46 20.67,18.7 v20.7,18.73
  Bottom 0.61: v27.43,27.24 27.24,27.24 26.7,27.78 | v33.66,42.77 33.66,43.47 | 26.42,52.29 26.48,52.23 R5.1 28.83,50.92 v29.72,50.04 | 42.04,52.07 GND2.1 39.43,51.5 C11.2 | GND5.1 42.04,17.78 | C4.2 29.65,40.8 29.43,41.02 | C12.2 v41.95,28.8 42.04,28.89 | GND3.1 41.98,39.37 42.04,39.43 | 31.11,57.91 19.05,57.91 | v22.83,14 20.19,16.64 20.19,16.99 | 15.91,57.91 3.81,57.91 3.81,52.7 | 1.27,17.78 1.27,11.43 | 1.27,11.43 1.27,9.2 S1.3 3.81,6.66 3.81,0.64 17.18,0.64 | 3.81,52.7 3.81,49.53 | 3.81,49.53 3.81,43.81 | 3.81,43.81 3.81,40.64 | 3.81,40.64 3.81,34.92 | 3.81,34.92 3.81,31.75 | 3.81,31.75 3.81,26.04 | 3.81,26.04 3.81,22.86 | GND4.1 1.27,17.78 | S3.1 1.55,49.53 3.81,49.53 | S2.1 1.55,40.64 3.81,40.64 | S4.1 1.55,31.75 3.81,31.75 | S5.1 1.55,22.86 3.81,22.86 | v14.35,24.45 15.18,23.62 15.18,23.56 | v19.65,30.48 22.19,27.94 v22.19,27.3 | C16.1 3.81,26.04 | C15.1 3.81,34.92 | C13.1 3.81,43.81 | C14.1 3.81,52.7 | LED.K 1.27,11.43 | 3.81,22.86 1.27,20.32 1.27,17.78
  Bottom 0.813: 24.55,47.24 24.86,47.24 | 24.86,47.24 v24.86,46.01 24.86,45.09 | 24.86,47.24 24.86,47.7
  pour Top (isolate 0.254, rank 2, hatched): 0,58.42 42.55,58.42 42.55,0 0,0
  pour Bottom (isolate 0.254, hatched): 0,58.42 42.55,58.42 42.55,0 0,0
MOSI
  Bottom 0.127: U5.19
N$3
  Bottom 0.61: 6.67,11.39 R1.2 5.11,11.46 LED.A
N$5
  Bottom 0.203: U5.1 20.68,19.89 X1.P$1
  Bottom 0.406: X1.P$1 19.56,18.9 19.56,18.83 C2.1
N$7
  Bottom 0.203: U5.2 20.59,20.39 X1.P$2
  Bottom 0.406: X1.P$2 17.42,21.3 C3.1
N$16
  Bottom 0.254: 23.52,7.1 D2.A
  Bottom 0.305: CON1.VBUS 23.52,7.1
N$26
  Bottom 0.254: U3.1 24.47,48.54 24.48,48.55
  Bottom 0.61: R4.1 R5.2 25.4,49.02 24.92,48.54 24.47,48.54
N$29
  Bottom 0.254: U3.18 23.95,49.44 24.23,49.72
  Bottom 0.406: 24.23,49.72 24.23,51.21 R6.2
PWM
  Bottom 0.61: U4.4 37.17,46.99 PWM.1
SCL
  Bottom 0.203: U5.32 30.3,21.89 30.67,22.26 30.86,22.26
  Bottom 0.406: 30.86,22.26 36.16,22.26 | 36.16,22.26 38.1,20.32 SCL.1 | R7.2 36.16,23.14 36.16,22.26
SDA
  Bottom 0.203: U5.31 30.23,22.39 30.8,22.95 30.86,22.95
  Bottom 0.406: SDA.1 38.01,22.86 37.66,23.21 37.66,24.67 37.08,25.24 R8.2 36.03,26.04 35.81,26.26 33.5,26.26 33.18,25.94 33.18,23.34 32.8,22.95 30.86,22.95
SWCLK
  Bottom 0.203: 24.32,17.72 24.79,18.18 U5.45
  Bottom 0.406: 24.32,17.72 23.81,17.21 23.81,15.56 24.13,15.24 25.56,15.24 30.73,10.06 32.67,10.06 34.92,7.81 SWCLK.1
SWDIO
  Bottom 0.203: 23.84,18.07 24.29,18.51 U5.46
  Bottom 0.406: SWDIO.1 35.75,5.91 34.23,5.91 33.34,6.79 33.34,8.48 32.38,9.43 30.48,9.43 25.21,14.7 23.78,14.7 23.21,15.27 23.21,17.43 23.84,18.07
VBAT  (via drill 0.35)
  Top 0.61: BAT.PWR 28.61,44.42 v27.43,43.24
  Bottom 0.254: U3.16 22.48,50.35
  Bottom 0.61: 22.48,50.35 22.48,51.25 | 22.48,51.25 C9.1 | BAT.PWR 23.65,55.24 22.48,54.07 22.48,51.25 | D1.A 26.71,42.52 v27.43,43.24
VBUS  (via drill 0.35)
  Top 0.61: v30.77,32 30.77,26.26 31.75,25.3 31.75,19.53 30.57,18.35 30.57,13.84 30.67,13.75 | 30.67,13.75 31.34,13.75 VBUS.1 | 30.67,13.75 29.11,13.75 27.69,12.32 v23.59,12.32
  Bottom 0.508: U2.3 28.98,33.37 28.61,33.75 28.61,35.56 28.89,35.27 U2.1
  Bottom 0.61: v23.59,12.32 23.59,10.87 D2.C | R2.2 16.77,30.2 18.57,32 29.84,32 | 29.84,32 v30.77,32 | U2.3 29.88,32.03 29.84,32 | D1.C 25.53,37.88 26.51,36.89 27.63,36.89 27.75,37.02 | 27.75,37.02 C4.1 | 28.61,35.56 28.61,35.81 27.75,36.67 27.75,37.02
VDDCORE1
  Bottom 0.127: U5.43
  Bottom 0.203: U5.43 25.78,17.49 25.18,16.9 C1.1

### Text on the board
Top: TOP
Bottom: BOTTOM
tPlace: Balloon / Cut-Down / V1
bPlace: - | + | Balloon / Cut-Down / V1
tNames: CLOSE | GND | OPEN | + | GND | - | 3V3SW | 3V3SW | GND | GND | - | !RST | GND | RESET